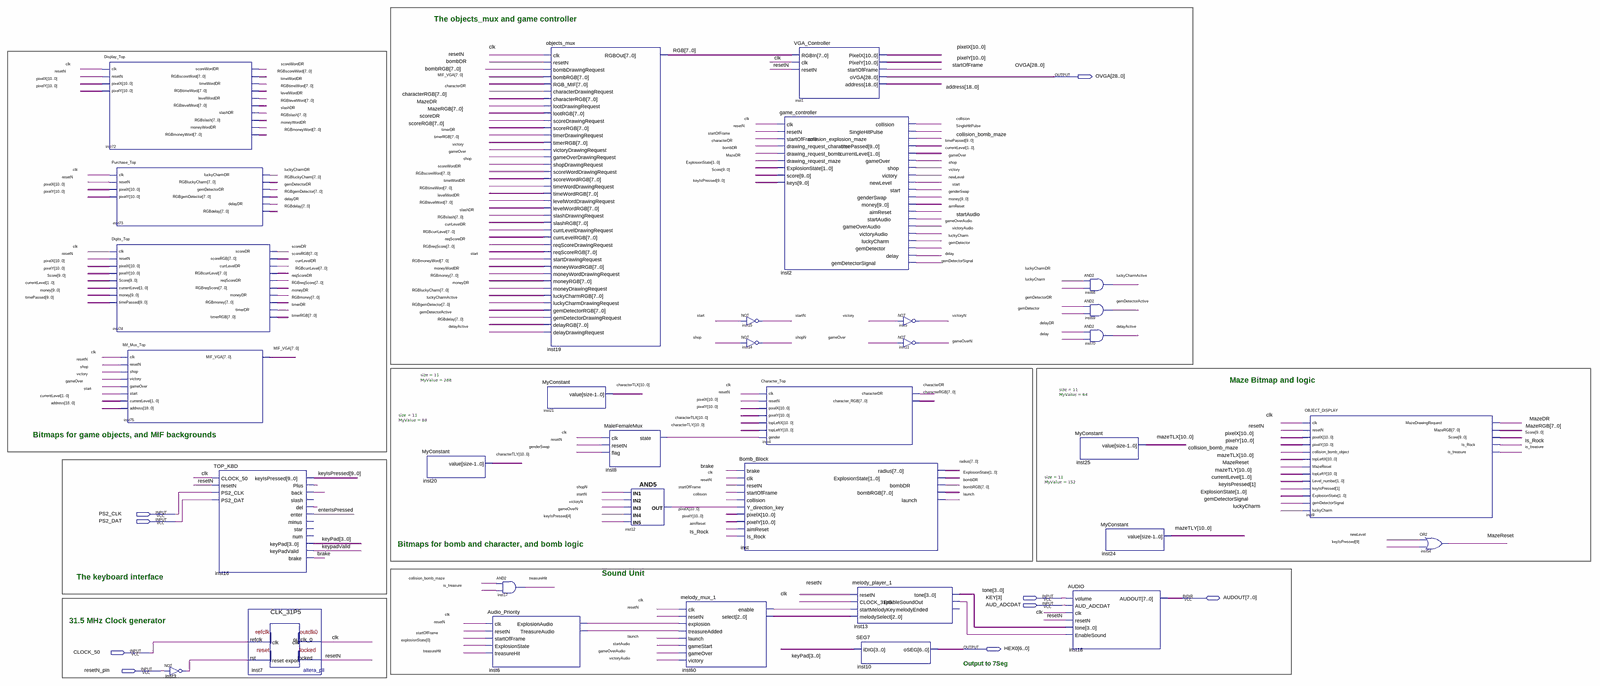
[diagram p0: schematic sheet, whole]
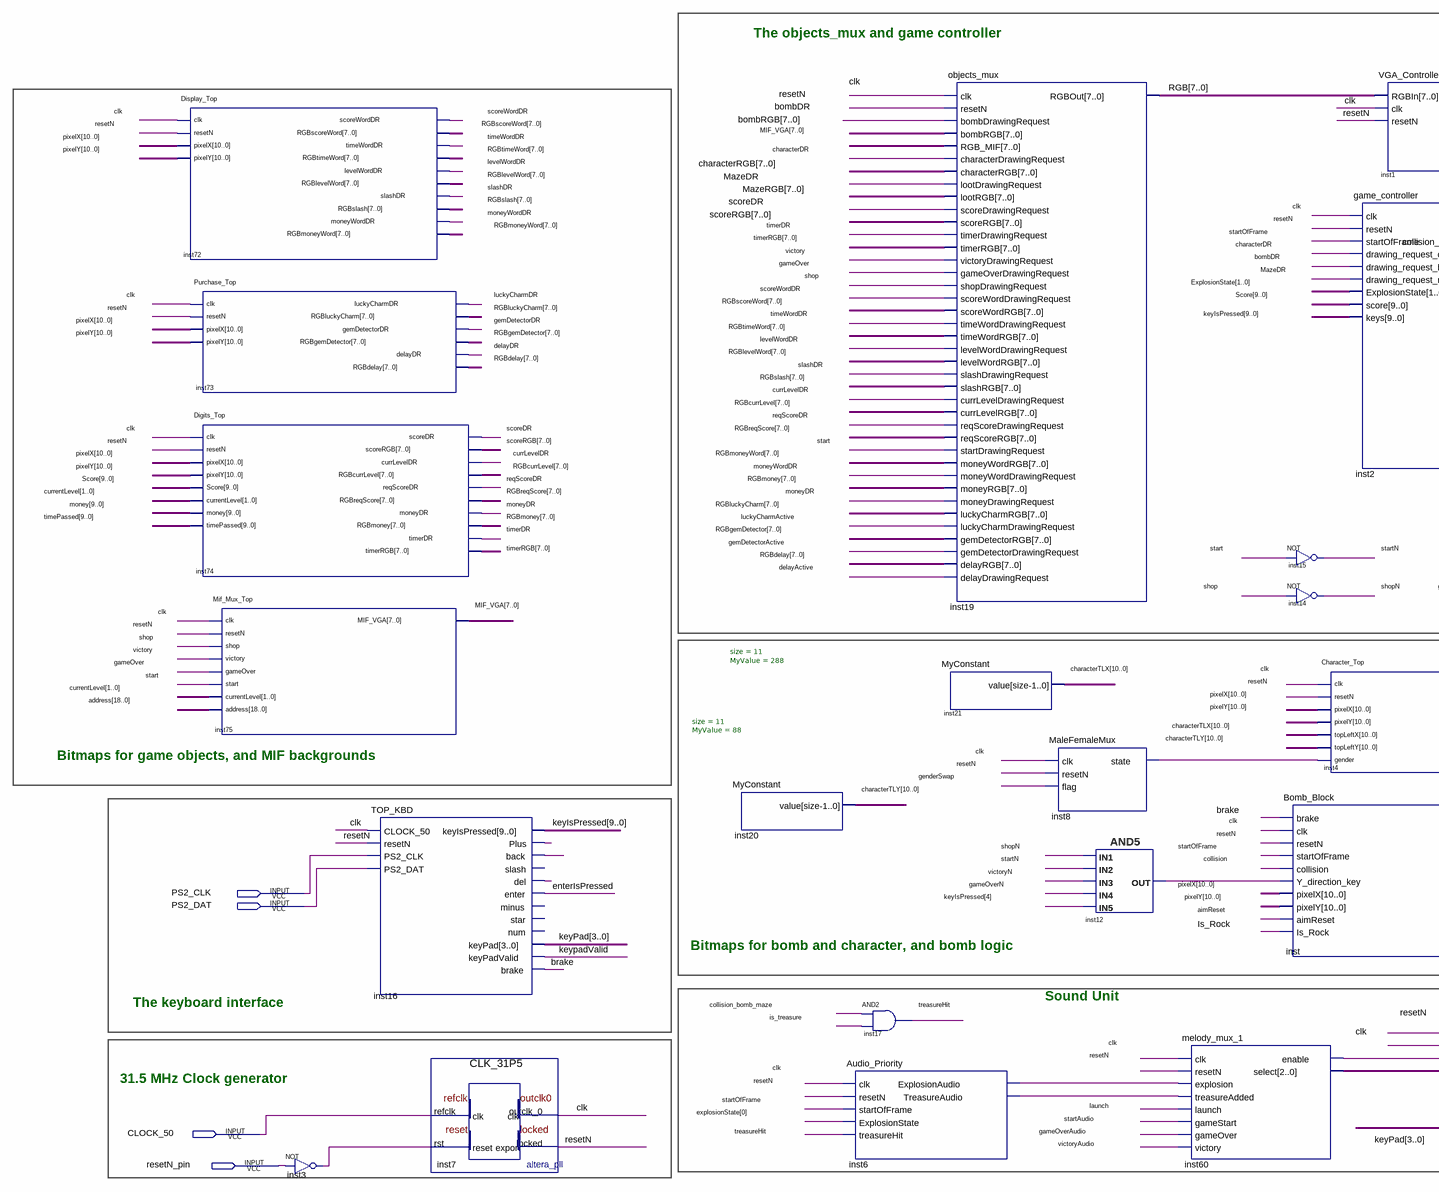
[diagram p1: schematic sheet, left part]
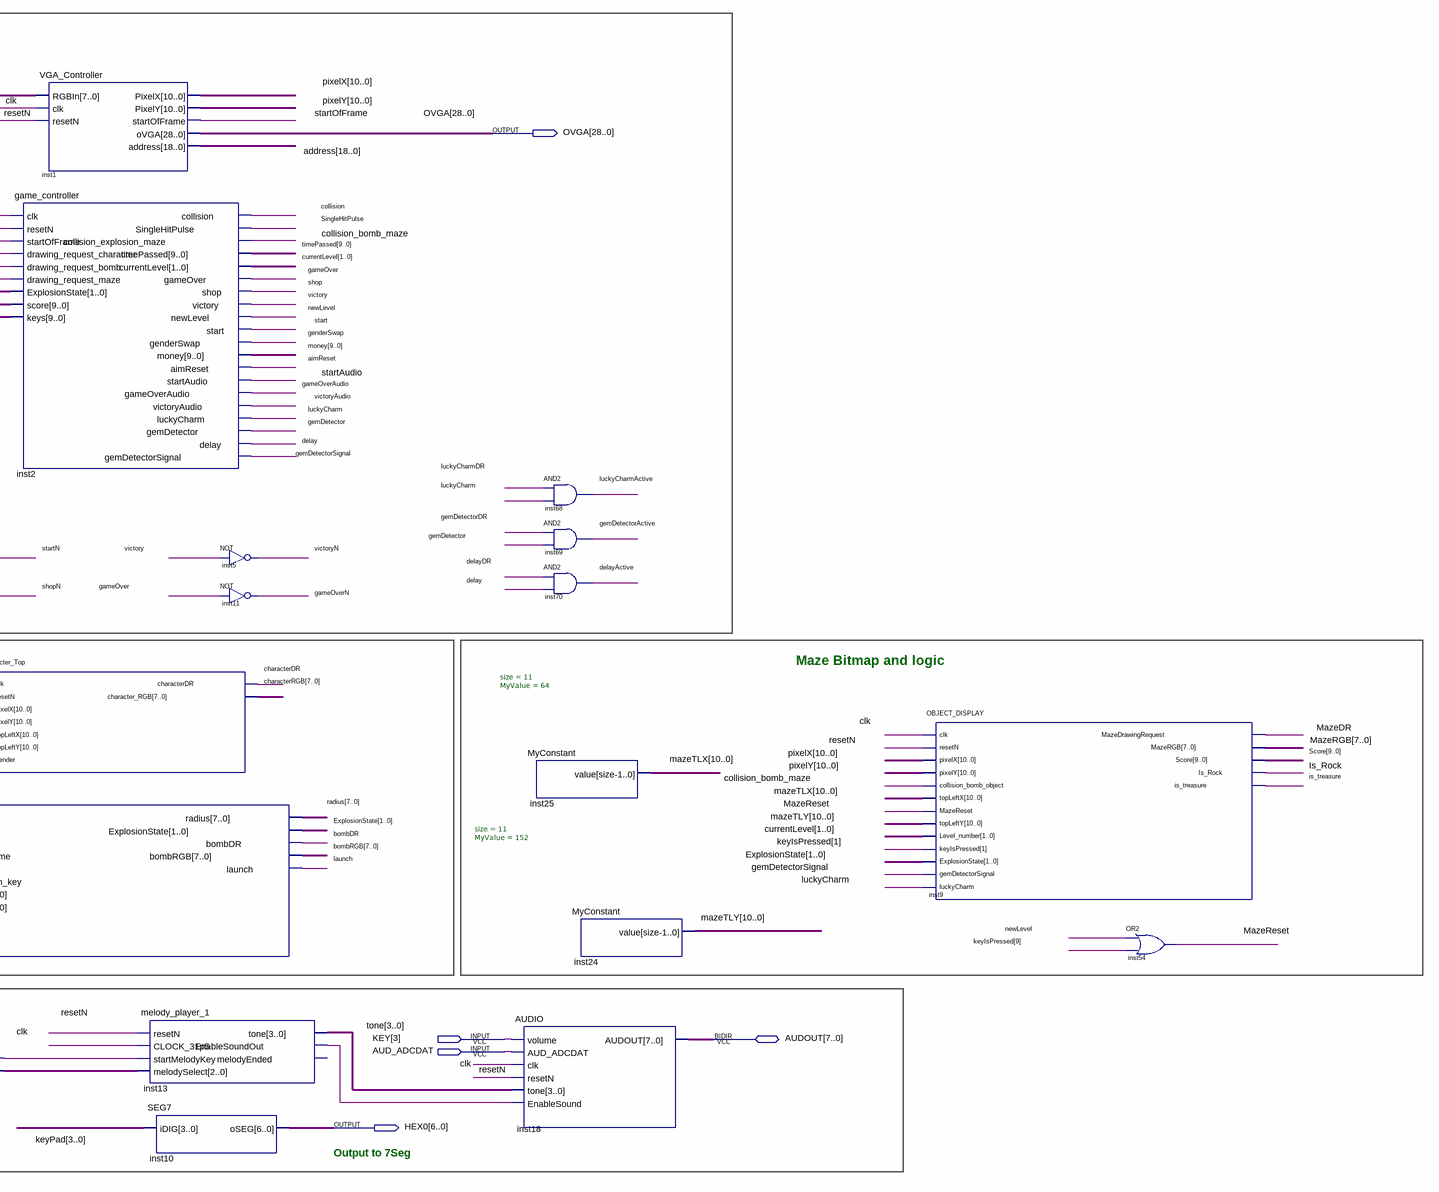
[diagram p2: schematic sheet, right part]
// Quartus schematic TOP_PROJECT_KBD.bdf as structural Verilog: 33 symbols, 9 pins
module TOP_PROJECT_KBD (
  input  PS2_CLK,
  input  PS2_DAT,
  input  [3:3] KEY,
  input  AUD_ADCDAT,
  input  CLOCK_50,
  input  resetN_pin,
  inout  [7:0] AUDOUT,
  output [28:0] OVGA,
  output [6:0] HEX0
);

  wire aimReset, bombDR, brake, characterDR, clk, collision, collision_bomb_maze, currLevelDR, delay,
       delayActive, delayDR, enterIsPressed, gameOver, gameOverAudio, gameOverN, gemDetector,
       gemDetectorActive, gemDetectorDR, gemDetectorSignal, genderSwap, inst3_out, inst6_explosionaudio,
       inst6_treasureaudio, inst8_state, inst12_out, inst13_enablesoundout, inst16_back, inst16_del,
       inst16_plus, inst60_enable, Is_Rock, is_treasure, keypadValid, launch, levelWordDR, luckyCharm,
       luckyCharmActive, luckyCharmDR, MazeDR, MazeReset, moneyDR, moneyWordDR, newLevel, reqScoreDR, resetN,
       scoreDR, scoreWordDR, shop, shopN, SingleHitPulse, slashDR, start, startAudio, startN, startOfFrame,
       timerDR, timeWordDR, treasureHit, victory, victoryAudio, victoryN;
  wire [1:0] currentLevel, ExplosionState;
  wire [2:0] inst60_select;
  wire [3:0] keyPad, tone;
  wire [7:0] bombRGB, characterRGB, MazeRGB, MIF_VGA, radius, RGB, RGBcurrLevel, RGBdelay, RGBgemDetector,
       RGBlevelWord, RGBluckyCharm, RGBmoney, RGBmoneyWord, RGBreqScore, RGBscoreWord, RGBslash, RGBtimeWord,
       scoreRGB, timerRGB;
  wire [9:0] keyIsPressed, money, Score, timePassed;
  wire [10:0] characterTLX, characterTLY, mazeTLX, mazeTLY, pixelX, pixelY;
  wire [18:0] address;

  Display_Top inst72 (
    .clk(clk), .resetN(resetN), .pixelX(pixelX), .pixelY(pixelY), .scoreWordDR(scoreWordDR),
    .RGBscoreWord(RGBscoreWord), .timeWordDR(timeWordDR), .RGBtimeWord(RGBtimeWord),
    .levelWordDR(levelWordDR), .RGBlevelWord(RGBlevelWord), .slashDR(slashDR), .RGBslash(RGBslash),
    .moneyWordDR(moneyWordDR), .RGBmoneyWord(RGBmoneyWord));
  Purchase_Top inst73 (
    .clk(clk), .resetN(resetN), .pixelX(pixelX), .pixelY(pixelY), .luckyCharmDR(luckyCharmDR),
    .RGBluckyCharm(RGBluckyCharm), .gemDetectorDR(gemDetectorDR), .RGBgemDetector(RGBgemDetector),
    .delayDR(delayDR), .RGBdelay(RGBdelay));
  Digits_Top inst74 (
    .clk(clk), .resetN(resetN), .pixelX(pixelX), .pixelY(pixelY), .Score(Score), .currentLevel(currentLevel),
    .money(money), .timePassed(timePassed), .scoreDR(scoreDR), .scoreRGB(scoreRGB),
    .currLevelDR(currLevelDR), .RGBcurrLevel(RGBcurrLevel), .reqScoreDR(reqScoreDR),
    .RGBreqScore(RGBreqScore), .moneyDR(moneyDR), .RGBmoney(RGBmoney), .timerDR(timerDR), .timerRGB(timerRGB));
  Mif_Mux_Top inst75 (
    .clk(clk), .resetN(resetN), .shop(shop), .victory(victory), .gameOver(gameOver), .start(start),
    .currentLevel(currentLevel), .address(address), .MIF_VGA(MIF_VGA));
  not inst3 (inst3_out, resetN_pin);
  TOP_KBD inst16 (
    .CLOCK_50(clk), .resetN(resetN), .PS2_CLK(PS2_CLK), .PS2_DAT(PS2_DAT), .keyIsPressed(keyIsPressed),
    .Plus(inst16_plus), .back(inst16_back), .del(inst16_del), .enter(enterIsPressed), .keyPad(keyPad),
    .keyPadValid(keypadValid), .brake(brake));  // open: slash, minus, star, num
  CLK_31P5 inst7 (.refclk(CLOCK_50), .rst(inst3_out), .outclk_0(clk), .locked(resetN));
  MyConstant #(.size(11), .MyValue(88)) inst20 (.value(characterTLY));
  Audio_Priority inst6 (
    .clk(clk), .resetN(resetN), .startOfFrame(startOfFrame), .ExplosionState(ExplosionState[0]),
    .treasureHit(treasureHit), .ExplosionAudio(inst6_explosionaudio), .TreasureAudio(inst6_treasureaudio));
  and inst17 (treasureHit, collision_bomb_maze, is_treasure);
  objects_mux inst19 (
    .clk(clk), .resetN(resetN), .bombDrawingRequest(bombDR), .bombRGB(bombRGB), .RGB_MIF(MIF_VGA),
    .characterDrawingRequest(characterDR), .characterRGB(characterRGB), .lootDrawingRequest(MazeDR),
    .lootRGB(MazeRGB), .scoreDrawingRequest(scoreDR), .scoreRGB(scoreRGB), .timerDrawingRequest(timerDR),
    .timerRGB(timerRGB), .victoryDrawingRequest(victory), .gameOverDrawingRequest(gameOver),
    .shopDrawingRequest(shop), .scoreWordDrawingRequest(scoreWordDR), .scoreWordRGB(RGBscoreWord),
    .timeWordDrawingRequest(timeWordDR), .timeWordRGB(RGBtimeWord), .levelWordDrawingRequest(levelWordDR),
    .levelWordRGB(RGBlevelWord), .slashDrawingRequest(slashDR), .slashRGB(RGBslash),
    .currLevelDrawingRequest(currLevelDR), .currLevelRGB(RGBcurrLevel), .reqScoreDrawingRequest(reqScoreDR),
    .reqScoreRGB(RGBreqScore), .startDrawingRequest(start), .moneyWordRGB(RGBmoneyWord),
    .moneyWordDrawingRequest(moneyWordDR), .moneyRGB(RGBmoney), .moneyDrawingRequest(moneyDR),
    .luckyCharmRGB(RGBluckyCharm), .luckyCharmDrawingRequest(luckyCharmActive),
    .gemDetectorRGB(RGBgemDetector), .gemDetectorDrawingRequest(gemDetectorActive), .delayRGB(RGBdelay),
    .delayDrawingRequest(delayActive), .RGBOut(RGB));
  MyConstant #(.size(11), .MyValue(288)) inst21 (.value(characterTLX));
  MaleFemaleMux inst8 (.clk(clk), .resetN(resetN), .flag(genderSwap), .state(inst8_state));
  and inst12 (inst12_out, shopN, startN, victoryN, gameOverN, keyIsPressed[4]);
  melody_mux_1 inst60 (
    .clk(clk), .resetN(resetN), .explosion(inst6_explosionaudio), .treasureAdded(inst6_treasureaudio),
    .launch(launch), .gameStart(startAudio), .gameOver(gameOverAudio), .victory(victoryAudio),
    .enable(inst60_enable), .select(inst60_select));
  not inst15 (startN, start);
  not inst14 (shopN, shop);
  Bomb_Block inst (
    .brake(brake), .clk(clk), .resetN(resetN), .startOfFrame(startOfFrame), .collision(collision),
    .Y_direction_key(inst12_out), .pixelX(pixelX), .pixelY(pixelY), .aimReset(aimReset), .Is_Rock(Is_Rock),
    .radius(radius), .ExplosionState(ExplosionState), .bombDR(bombDR), .bombRGB(bombRGB), .launch(launch));
  game_controller inst2 (
    .clk(clk), .resetN(resetN), .startOfFrame(startOfFrame), .drawing_request_character(characterDR),
    .drawing_request_bomb(bombDR), .drawing_request_maze(MazeDR), .ExplosionState(ExplosionState),
    .score(Score), .keys(keyIsPressed), .collision(collision), .SingleHitPulse(SingleHitPulse),
    .collision_explosion_maze(collision_bomb_maze), .timePassed(timePassed), .currentLevel(currentLevel),
    .gameOver(gameOver), .shop(shop), .victory(victory), .newLevel(newLevel), .start(start),
    .genderSwap(genderSwap), .money(money), .aimReset(aimReset), .startAudio(startAudio),
    .gameOverAudio(gameOverAudio), .victoryAudio(victoryAudio), .luckyCharm(luckyCharm),
    .gemDetector(gemDetector), .delay(delay), .gemDetectorSignal(gemDetectorSignal));
  Character_Top inst4 (
    .clk(clk), .resetN(resetN), .pixelX(pixelX), .pixelY(pixelY), .topLeftX(characterTLX),
    .topLeftY(characterTLY), .gender(inst8_state), .characterDR(characterDR), .character_RGB(characterRGB));
  VGA_Controller inst1 (
    .RGBIn(RGB), .clk(clk), .resetN(resetN), .PixelX(pixelX), .PixelY(pixelY), .startOfFrame(startOfFrame),
    .oVGA(OVGA), .address(address));
  melody_player_1 inst13 (
    .resetN(resetN), .CLOCK_31p5(clk), .startMelodyKey(inst60_enable), .melodySelect(inst60_select),
    .tone(tone), .EnableSoundOut(inst13_enablesoundout));  // open: melodyEnded
  SEG7 inst10 (.iDIG(keyPad), .oSEG(HEX0));
  not inst5 (victoryN, victory);
  not inst11 (gameOverN, gameOver);
  AUDIO inst18 (
    .volume(KEY[3]), .AUD_ADCDAT(AUD_ADCDAT), .clk(clk), .resetN(resetN), .tone(tone),
    .EnableSound(inst13_enablesoundout), .AUDOUT(AUDOUT));
  and inst68 (luckyCharmActive, luckyCharmDR, luckyCharm);
  and inst69 (gemDetectorActive, gemDetectorDR, gemDetector);
  and inst70 (delayActive, delayDR, delay);
  MyConstant #(.size(11), .MyValue(64)) inst25 (.value(mazeTLX));
  MyConstant #(.size(11), .MyValue(152)) inst24 (.value(mazeTLY));
  OBJECT_DISPLAY inst9 (
    .clk(clk), .resetN(resetN), .pixelX(pixelX), .pixelY(pixelY),
    .collision_bomb_object(collision_bomb_maze), .topLeftX(mazeTLX), .MazeReset(MazeReset),
    .topLeftY(mazeTLY), .Level_number(currentLevel), .keyIsPressed(keyIsPressed[1]),
    .ExplosionState(ExplosionState), .gemDetectorSignal(gemDetectorSignal), .luckyCharm(luckyCharm),
    .MazeDrawingRequest(MazeDR), .MazeRGB(MazeRGB), .Score(Score), .Is_Rock(Is_Rock),
    .is_treasure(is_treasure));
  or inst54 (MazeReset, newLevel, keyIsPressed[9]);

  // Notes on the sheet:
  //   The objects_mux and game controller
  //   Maze Bitmap and logic
  //   Bitmaps for game objects, and MIF backgrounds
  //   Bitmaps for bomb and character, and bomb logic
  //   Sound Unit
  //   The keyboard interface
  //   31.5 MHz Clock generator
  //   Output to 7Seg
endmodule
